# EAGLE design bxdrone (EAGLE 7.6.0)
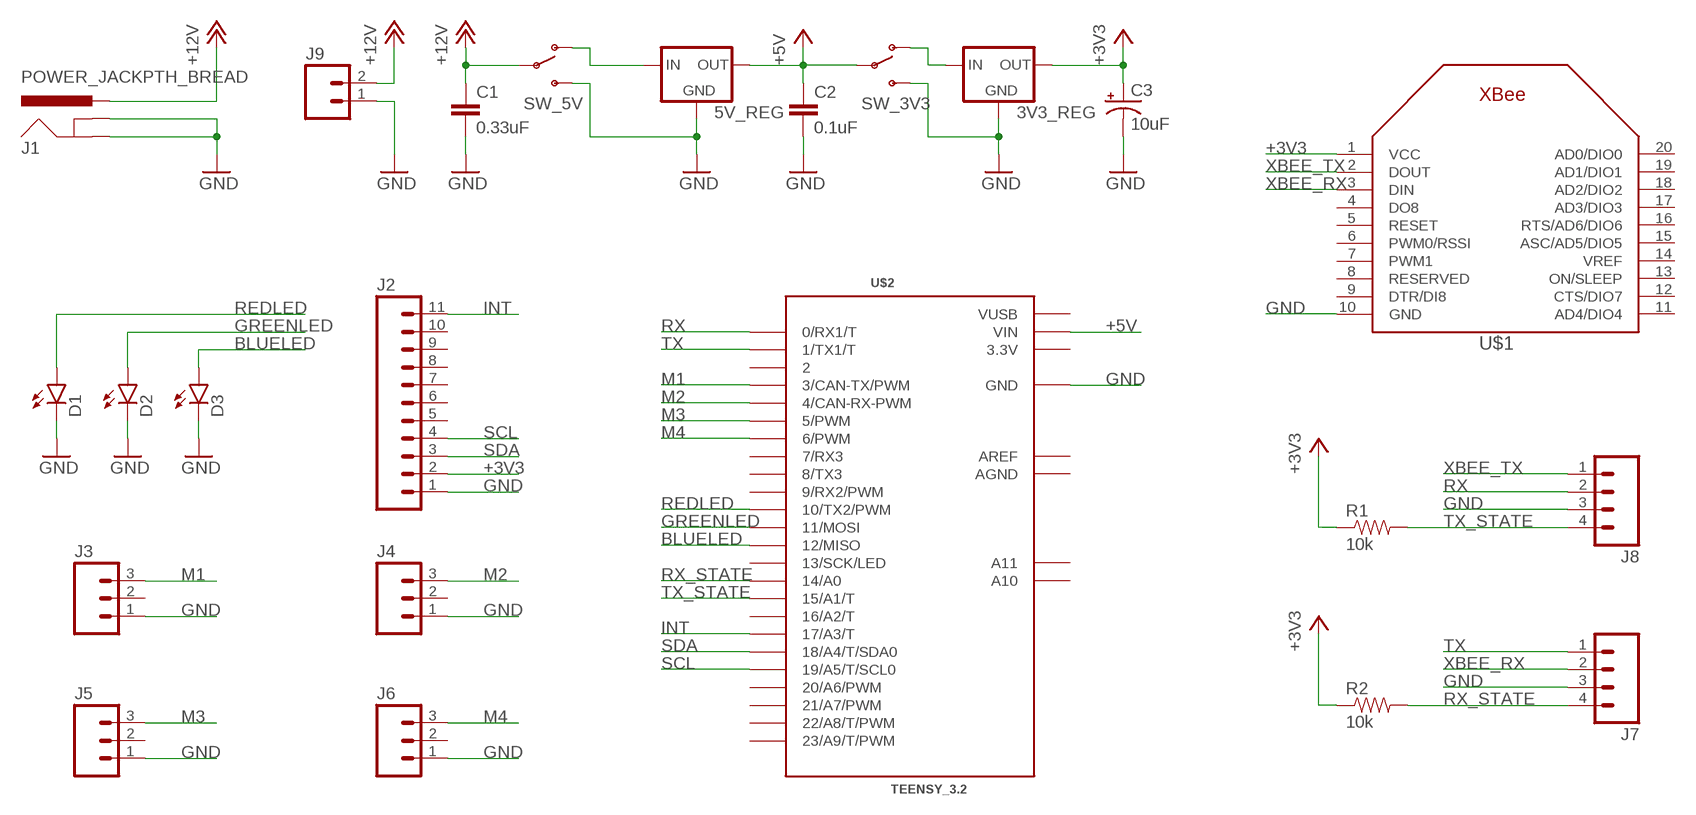
[diagram p0: schematic, sheet 1]

## Parts
3V3_REG  LD1117V33  [TO-220-STANDING]
5V_REG  L78S05CV  [TO-220-STANDING]
C1  0.33uF  CAPPTH  [CAP-PTH-SMALL]
C2  0.1uF  CAPPTH  [CAP-PTH-SMALL]
C3  10uF  CAP_POLPTH2  [CPOL-RADIAL-10UF-25V]
D1  LED5MM  [LED5MM]
D2  LED5MM  [LED5MM]
D3  LED5MM  [LED5MM]
J1  POWER_JACKPTH_BREAD  [POWER_JACK_PTH_BREAD]
J2  M11PTH  [1X11]
J3  M03PTH  [1X03]
J4  M03PTH  [1X03]
J5  M03PTH  [1X03]
J6  M03PTH  [1X03]
J7  M04PTH  [1X04]
J8  M04PTH  [1X04]
J9  M02JST-PTH-VERT  [JST-2-PTH-VERT]
R1  10k  RESISTORPTH-1/4W  [AXIAL-0.4]
R2  10k  RESISTORPTH-1/4W  [AXIAL-0.4]
SW_3V3  SWITCH-SPDTPTH  [SWITCH-SPDT]
SW_5V  SWITCH-SPDTPTH  [SWITCH-SPDT]
U$1  XBEE  [XBEE]
U$2  TEENSY_3.2  TEENSY_3.1_DIL+4  [TEENSY3-DIL+4]

## Nets
+3V3: 3V3_REG.2(OUT) C3.1(+) J2.2 R1.P$1 R2.P$1 U$1.1(VCC)
+5V: 5V_REG.3(OUT) C2.1 SW_3V3.2(P) U$2.VIN
+12V: C1.1 J1.PWR J9.2 SW_5V.2(P)
BLUELED: D3.A U$2.12(12/MISO)
GND: 3V3_REG.1(GND) 5V_REG.2(GND) C1.2 C2.2 C3.2(-) D1.K(C) D2.K(C) D3.K(C) J1.GND J1.GNDBREAK J2.1 J3.1 J4.1 J5.1 J6.1 J7.3 J8.3 J9.1 SW_3V3.3(S) SW_5V.3(S) U$1.10(GND) U$2.GND
GREENLED: D2.A U$2.11(11/MOSI)
INT: J2.11 U$2.17/A3(17/A3/T)
M1: J3.3 U$2.3(3/CAN-TX/PWM)
M2: J4.3 U$2.4(4/CAN-RX-PWM)
M3: J5.3 U$2.5(5/PWM)
M4: J6.3 U$2.6(6/PWM)
N$1: 5V_REG.1(IN) SW_5V.1(O)
N$2: 3V3_REG.3(IN) SW_3V3.1(O)
REDLED: D1.A U$2.10(10/TX2/PWM)
RX: J8.2 U$2.0(0/RX1/T)
RX_STATE: J7.4 R2.P$2 U$2.14/A0
SCL: J2.4 U$2.19/A5(19/A5/T/SCL0)
SDA: J2.3 U$2.18/A4(18/A4/T/SDA0)
TX: J7.1 U$2.1(1/TX1/T)
TX_STATE: J8.4 R1.P$2 U$2.15/A1(15/A1/T)
XBEE_RX: J7.2 U$1.3(DIN)
XBEE_TX: J8.1 U$1.2(DOUT)
Unconnected: J2.5 J2.6 J2.7 J2.8 J2.9 J2.10 J3.2 J4.2 J5.2 J6.2 U$1.4(DO8) U$1.5(RESET) U$1.6(PWM0/RSSI) U$1.7(PWM1) U$1.8(RESERVED) U$1.9(DTR/DI8) U$1.11(AD4/DIO4) U$1.12(CTS/DIO7) U$1.13(ON/SLEEP) U$1.14(VREF) U$1.15(ASC/AD5/DIO5) U$1.16(RTS/AD6/DIO6) U$1.17(AD3/DIO3) U$1.18(AD2/DIO2) U$1.19(AD1/DIO1) U$1.20(AD0/DIO0) U$2.2 U$2.7(7/RX3) U$2.8(8/TX3) U$2.9(9/RX2/PWM) U$2.13(13/SCK/LED) U$2.16/A2(16/A2/T) U$2.20/A6(20/A6/PWM) U$2.21/A7(21/A7/PWM) U$2.22/A8(22/A8/T/PWM) U$2.23/A9(23/A9/T/PWM) U$2.A10 U$2.A11

## Power pins joined to a net without a drawn wire
3.3V: U$2.3.3V
AGND: U$2.AGND
AREF: U$2.AREF
VUSB: U$2.VUSB

## Library data of the parts
3V3_REG = SM-VReg:LD1117V33; CURRENT: 0.8 A; MANUFACTURER: ST Microelectronics; PACKAGE: TO-220; TME: LD1117V33; VIN-MAX: 15.0 V; VIN-MIN: 4.5V; VOUT: 3.3 V
5V_REG = SM-VReg:L78S05CV; CURRENT: 2.0 A; MANUFACTURER: St Microelectronics; PACKAGE: TO-220; TME: L78S05CV; VIN-MAX: 35.0 V; VIN-MIN: 8.0 V; VOUT: 5.0 V
C1 C2 = SparkFun-Capacitors:CAP: Capacitor Standard 0603 ceramic capacitor, and 0.1" leaded capacitor.
C3 = SparkFun-Passives:CAP_POL: Capacitor Polarized These are standard SMD and PTH capacitors. Normally 10uF, 47uF, and 100uF in electrolytic and tantalum varieties. Always verify the external diameter of the through hole cap, it varies with capacity, voltage, and manufacturer. The EIA devices should be standard.
D1-D3 = SparkFun-LED:LED: LEDs Standard schematic elements and footprints for 5mm, 3mm, 1206, and 0603 sized LEDs. 5mm - Spark Fun Electronics SKU : COM-00529 (and others)
J1 = SparkFun-Connectors:POWER_JACK: Power Jack This is the standard 5.5mm barrel jack for power. The PTH is the most common, proven, reliable, footprint. The Slot footprint only works if the mill layer is transmitted to the PCB fab house so be warned. Mating wall wart : TOL-00298 (and others); PROD_ID: PRT-10811
J2 = SparkFun-Connectors:M11: Header 11 Standard 11-pin 0.1" header. Use with straight break away headers (SKU : PRT-00116), right angle break away headers (PRT-00553), swiss pins (PRT-00743), machine pins (PRT-00117), and female headers (PRT-00115).
J3-J6 = SparkFun-Connectors:M03: Header 3 Standard 3-pin 0.1" header. Use with straight break away headers (SKU : PRT-00116), right angle break away headers (PRT-00553), swiss pins (PRT-00743), machine pins (PRT-00117), and female headers (PRT-00115). Molex polarized connector foot print use with SKU : PRT-08232 with associated crimp pins and housings.
J7 J8 = SparkFun-Connectors:M04: Header 4 Standard 4-pin 0.1" header. Use with straight break away headers (SKU : PRT-00116), right angle break away headers (PRT-00553), swiss pins (PRT-00743), machine pins (PRT-00117), and female headers (PRT-00115). Molex polarized connector foot print use with SKU : PRT-08231 with associated crimp pins and housings. 1MM SMD Version SKU: PRT-10208; PROD_ID: CONN-09696
J9 = SparkFun-Connectors:M02: Standard 2-pin 0.1" header. Use with - straight break away headers ( PRT-00116) - right angle break away headers (PRT-00553) - swiss pins (PRT-00743) - machine pins (PRT-00117) - female headers (PRT-00115) Molex polarized connector foot print use with: PRT-08233 with associated crimp pins and housings. 2.54_SCREWTERM for use with PRT-10571. 3.5mm Screw Terminal footprints for PRT-08084 5mm Screw Terminal footprints for use with PRT-08432
R1 R2 = SparkFun-Resistors:RESISTOR: Resistor Basic schematic elements and footprints for 0603, 1206, and PTH resistors.
SW_3V3 SW_5V = SparkFun-Electromechanical:SWITCH-SPDT: SPDT Switch Simple slide switch, Spark Fun Electronics SKU : COM-00102 DPDT SMT slide switch, AYZ0202, SWCH-08179; PROD_ID: SWCH-08261
U$1 = adafruit:XBEE
U$2 = Teensy_3_and_LC_Series_Boards_v1.1:TEENSY_3.1_DIL+4: Teensy 3.1 and 3.2 in a DIL package with the inner 4 pins

## Board
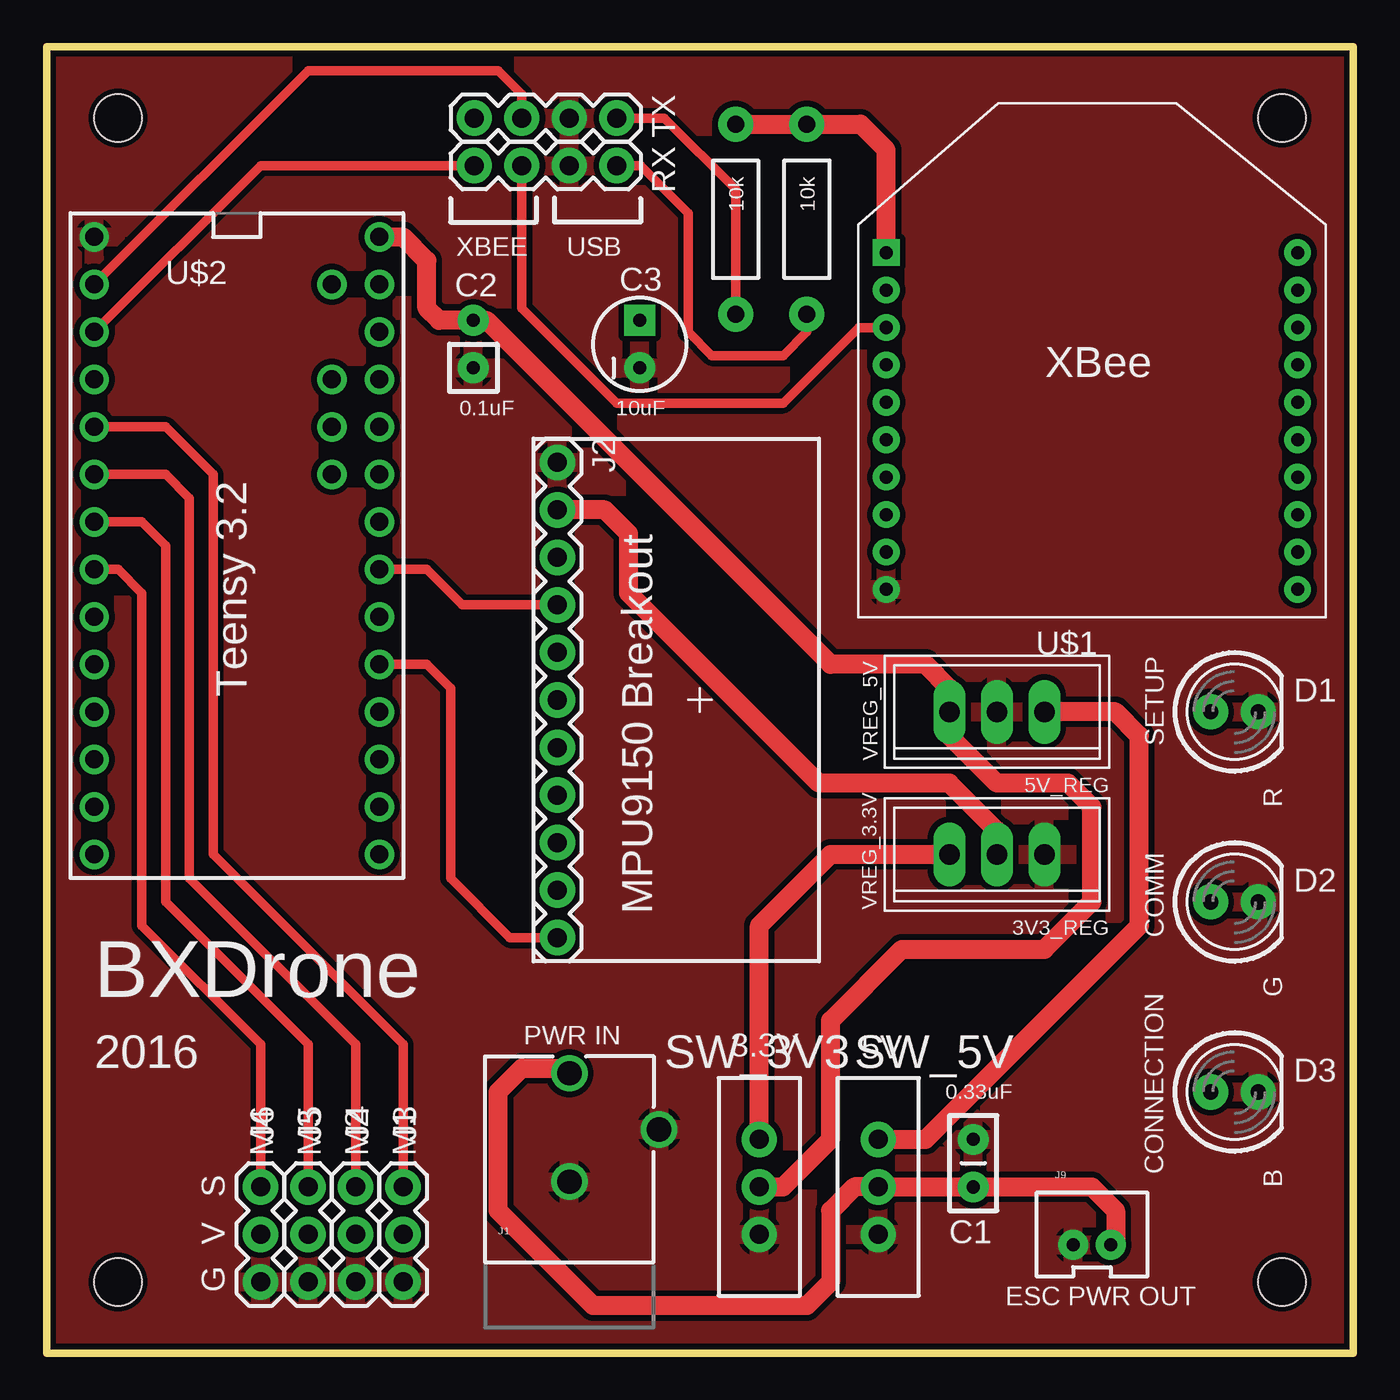
[diagram p1: board, top side]
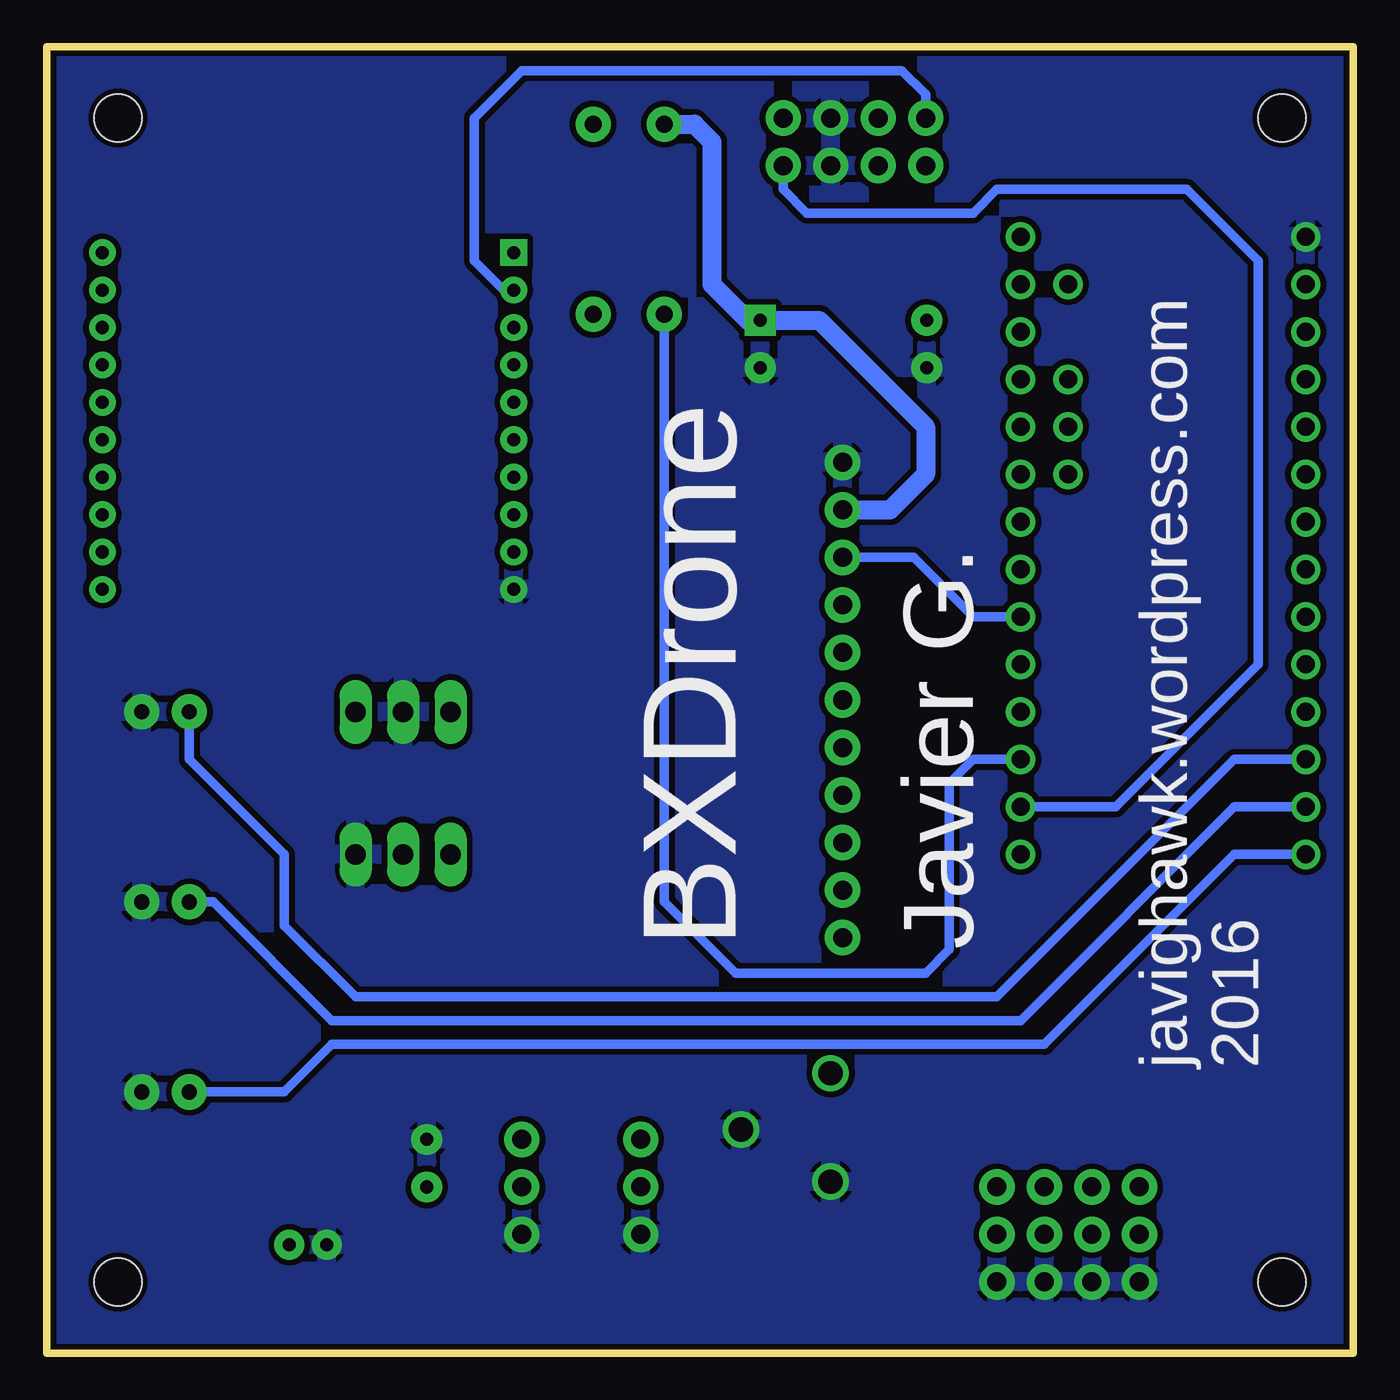
[diagram p2: board, bottom side, seen from below]

Size 69.85 x 69.85 mm. Coordinates in mm from the lower left corner, seen from the top.
Outline: 0,0 0,69.85 69.85,69.85 69.85,0 0,0
Copper layers (1*16): Top 0.035mm / dielectric 1.5mm / Bottom 0.035mm
Design rules "SparkFun": minimum track width 8mil, minimum drill 20mil, track to track 8mil, track to pad 8mil, pad to pad 8mil, via to via 8mil, smd to smd 8mil, copper to edge 10mil, drill to drill 8mil, minimum pad ring 12mil, minimum via ring 10mil, stop-mask expansion 4mil, vias tented up to drill 25mil, thermal gap 10mil
Holes 2.54 mm at 3.81,3.81 66.04,3.81 66.04,66.04 3.81,66.04

### Footprints (pad centres in the part's own frame; a part is rotated, then mirrored left to right if it is on the bottom)
TO-220-STANDING = drill 1.1 long: 1 -2.54,0; 2 0,0; 3 2.54,0
CAP-PTH-SMALL = drill 0.7 pad 1.651: 1 0,0; 2 2.54,0
CPOL-RADIAL-10UF-25V = drill 0.7 pad 1.651 square: 1 1.27,0 | drill 0.7 pad 1.651: 2 -1.27,0
LED5MM = drill 0.813 pad 1.88: A -1.27,0; K 1.27,0
POWER_JACK_PTH_BREAD = drill 1.3: GND 0,7.9; GNDBREAK 4.8,10.7; PWR 0,13.7
1X11 = drill 1.016 pad 1.88: 1 0,0; 2 2.54,0; 3 5.08,0; 4 7.62,0; 5 10.16,0; 6 12.7,0; 7 15.24,0; 8 17.78,0; 9 20.32,0; 10 22.86,0; 11 25.4,0
1X03 = drill 1.016 pad 1.88: 1 0,0; 2 2.54,0; 3 5.08,0
1X04 = drill 1.016 pad 1.88: 1 0,0; 2 2.54,0; 3 5.08,0; 4 7.62,0
JST-2-PTH-VERT = drill 0.7 pad 1.6: 1 -1,-0.55; 2 1,-0.55
AXIAL-0.4 = drill 0.9 pad 1.88: P$1 -5.08,0; P$2 5.08,0
SWITCH-SPDT = drill 1.016 pad 1.88: 1 0,2.54; 2 0,0; 3 0,-2.54
XBEE = drill 0.7 pad 1.422 square: 1 -11,5.5 | drill 0.7 pad 1.422: 2 -11,3.5; 3 -11,1.5; 4 -11,-0.5; 5 -11,-2.5; 6 -11,-4.5; 7 -11,-6.5; 8 -11,-8.5; 9 -11,-10.5; 10 -11,-12.5; 11 11,-12.5; 12 11,-10.5; 13 11,-8.5; 14 11,-6.5; 15 11,-4.5; 16 11,-2.5; 17 11,-0.5; 18 11,1.5; 19 11,3.5; 20 11,5.5
TEENSY3-DIL+4 = drill 0.965: 0 -7.62,13.97; 1 -7.62,11.43; 2 -7.62,8.89; 3 -7.62,6.35; 3.3V 7.62,11.43; 4 -7.62,3.81; 5 -7.62,1.27; 6 -7.62,-1.27; 7 -7.62,-3.81; 8 -7.62,-6.35; 9 -7.62,-8.89; 10 -7.62,-11.43; 11 -7.62,-13.97; 12 -7.62,-16.51; 13 7.62,-16.51; 14/A0 7.62,-13.97; 15/A1 7.62,-11.43; 16/A2 7.62,-8.89; 17/A3 7.62,-6.35; 18/A4 7.62,-3.81; 19/A5 7.62,-1.27; 20/A6 7.62,1.27; 21/A7 7.62,3.81; 22/A8 7.62,6.35; 23/A9 7.62,8.89; A10 5.08,6.35; A11 5.08,3.81; AGND 7.62,13.97; AREF 5.08,8.89; GND -7.62,16.51; VIN 7.62,16.51; VUSB 5.08,13.97

### Placement (x,y rotation side)
3V3_REG  50.8,26.67 180 top
5V_REG  50.8,34.29 180 top
C1  49.53,8.89 90 top
C2  22.81,55.22 270 top
C3  31.7,53.95 90 top
D1  63.5,34.29 0 top
D2  63.5,24.13 0 top
D3  63.5,13.97 0 top
J1  27.94,1.27 0 top
J2  27.3,47.62 270 top
J3  19.05,3.81 90 top
J4  16.51,3.81 90 top
J5  13.97,3.81 90 top
J6  11.43,3.81 90 top
J7  22.86,63.5 0 top
J8  22.86,66.04 0 top
J9  55.88,6.35 0 top
R1  36.83,60.63 270 top
R2  40.64,60.63 270 top
SW_3V3  38.1,8.89 0 top
SW_5V  44.45,8.89 0 top
U$1  55.88,53.34 0 top
U$2  10.16,43.18 0 top

### Tracks (layer width: path | path; a pad name or v marks a point on that pad's centre or on a via)
+3V3
  Top 1.016: R1.P$1 R2.P$1 43.51,65.71 44.88,64.34 U$1.1 | 3V3_REG.2 50.8,27.94 48.26,30.48 41.27,30.48 31.11,40.64 31.11,43.81 29.84,45.09 J2.2
  Bottom 1.016: R1.P$1 35.23,65.71 34.29,64.77 34.29,57.15 32.36,55.22 C3.1 28.55,55.22 22.86,49.53 22.86,46.99 24.77,45.09 J2.2
+5V
  Top 1.016: U$2.VIN 19.05,59.69 20.32,58.42 20.32,55.88 20.98,55.22 C2.1 23.52,55.22 41.91,36.83 46.99,36.83 48.26,35.56 5V_REG.3 48.26,33.02 50.8,30.48 54.61,30.48 55.88,29.21 55.88,24.13 53.34,21.59 45.72,21.59 41.91,17.78 41.91,11.43 39.37,8.89 SW_3V3.2
+12V
  Top 1.016: J1.PWR 27.67,15.24 25.4,15.24 24.13,13.97 24.13,7.62 29.21,2.54 40.64,2.54 41.91,3.81 41.91,7.62 43.18,8.89 SW_5V.2 C1.1 55.88,8.89 57.15,7.62 57.15,6.07 J9.2
BLUELED
  Bottom 0.508: D3.A 57.15,13.97 54.61,16.51 16.51,16.51 6.35,26.67 U$2.12
GND
  pour Top (isolate 0.305): 0,0 0,69.85 69.85,69.85 69.85,0
  pour Bottom (isolate 0.305): 0,0 0,69.85 69.85,69.85 69.85,0
GREENLED
  Bottom 0.508: D2.A 60.96,24.13 54.61,17.78 17.78,17.78 6.35,29.21 U$2.11
INT
  Top 0.508: U$2.17/A3 20.32,36.83 21.59,35.56 21.59,25.4 24.77,22.23 J2.11
M1
  Top 0.508: J3.3 19.05,16.51 8.89,26.67 8.89,46.99 6.35,49.53 U$2.3
M2
  Top 0.508: J4.3 16.51,16.51 7.62,25.4 7.62,45.72 6.35,46.99 U$2.4
M3
  Top 0.508: U$2.5 5.08,44.45 6.35,43.18 6.35,24.13 13.97,16.51 J5.3
M4
  Top 0.508: U$2.6 3.81,41.91 5.08,40.64 5.08,22.86 11.43,16.51 J6.3
N$1
  Top 1.016: 5V_REG.1 57.15,34.29 58.42,33.02 58.42,22.86 46.99,11.43 SW_5V.1
N$2
  Top 1.016: SW_3V3.1 38.1,22.86 41.91,26.67 3V3_REG.3
REDLED
  Bottom 0.508: D1.A 62.23,31.75 57.15,26.67 57.15,22.86 53.34,19.05 19.05,19.05 6.35,31.75 U$2.10
RX
  Top 0.508: J8.2 25.4,67.31 24.13,68.58 13.97,68.58 U$2.0
RX_STATE
  Top 0.508: J7.4 31.75,63.5 34.29,60.96 34.29,54.61 35.56,53.34 39.37,53.34 40.64,54.61 R2.P$2
  Bottom 0.508: U$2.14/A0 12.7,29.21 5.08,36.83 5.08,58.42 8.89,62.23 19.05,62.23 20.32,60.96 29.21,60.96 30.48,62.23 J7.4
SCL
  Top 0.508: U$2.19/A5 20.32,41.91 22.23,40.01 J2.4
SDA
  Bottom 0.508: U$2.18/A4 20.32,39.37 23.5,42.55 J2.3
TX
  Top 0.508: J7.1 11.43,63.5 U$2.1
TX_STATE
  Top 0.508: J8.4 33.02,66.04 36.83,62.23 R1.P$2
  Bottom 0.508: R1.P$2 36.83,24.13 33.02,20.32 22.86,20.32 21.59,21.59 21.59,30.48 20.32,31.75 U$2.15/A1
XBEE_RX
  Top 0.508: J7.2 25.4,55.88 30.48,50.8 39.37,50.8 43.41,54.84 U$1.3
XBEE_TX
  Bottom 0.508: J8.1 22.86,67.31 24.13,68.58 44.45,68.58 46.99,66.04 46.99,58.42 45.41,56.84 U$1.2

### Text on the board
tPlace: RX | TX | XBEE | USB | XBee | 0.1uF | 10uF | VREG_5V | Teensy 3.2 | SETUP | VREG_3.3V | R | MPU9150 Breakout | COMM | BXDrone | G | PWR IN | 3.3V | 5V | 2016 | 0.33uF | M4 | M3 | M2 | M1 | CONNECTION | B | S | V | G | ESC PWR OUT
bPlace: BXDrone | Javier G. | 2016 | javighawk.wordpress.com